# EAGLE design r2r_ladder_dac (EAGLE 6.2)
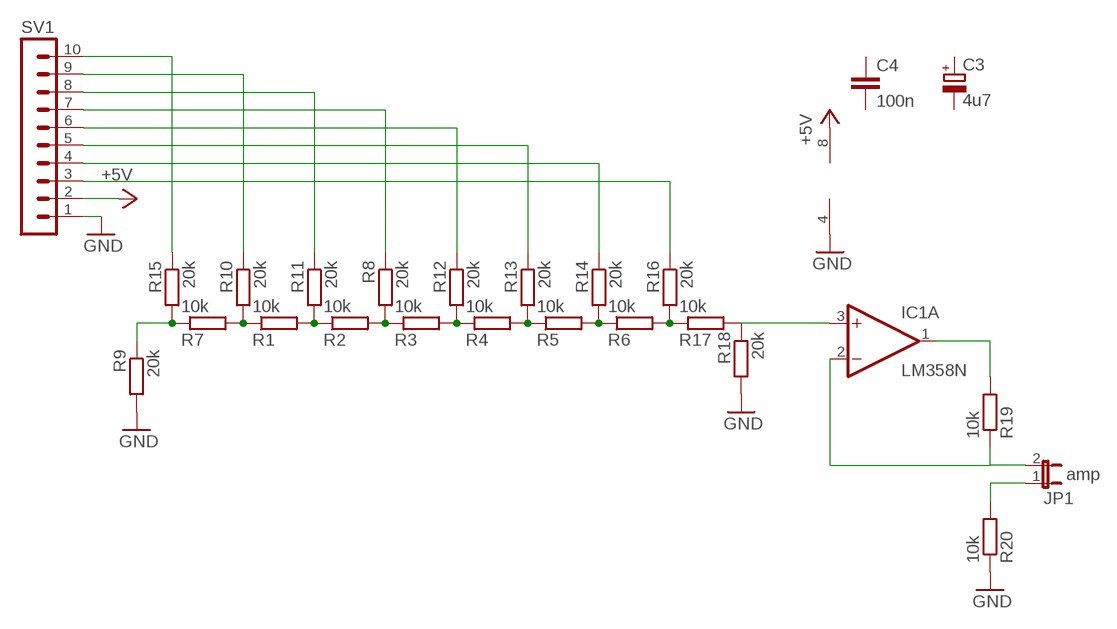
[diagram p0: schematic, sheet 1]

## Parts
C3  4u7  CPOL-EUTT2D5  [TT2D5]
C4  100n  C-EU025-024X044  [C025-024X044]
IC1  LM358N  [DIL08]
JP1  amp  JP1E  [JP1]
R1  10k  R-EU_0204/2V  [0204V]
R2  10k  R-EU_0204/2V  [0204V]
R3  10k  R-EU_0204/2V  [0204V]
R4  10k  R-EU_0204/2V  [0204V]
R5  10k  R-EU_0204/2V  [0204V]
R6  10k  R-EU_0204/2V  [0204V]
R7  10k  R-EU_0204/2V  [0204V]
R8  20k  R-EU_0207/10  [0207/10]
R9  20k  R-EU_0617/22  [0617/22]
R10  20k  R-EU_0207/10  [0207/10]
R11  20k  R-EU_0207/10  [0207/10]
R12  20k  R-EU_0207/10  [0207/10]
R13  20k  R-EU_0207/10  [0207/10]
R14  20k  R-EU_0207/10  [0207/10]
R15  20k  R-EU_0207/10  [0207/10]
R16  20k  R-EU_0207/10  [0207/10]
R17  10k  R-EU_0204/5  [0204/5]
R18  20k  R-EU_0207/10  [0207/10]
R19  10k  R-EU_0204/2V  [0204V]
R20  10k  R-EU_0204/2V  [0204V]
SV1  MA10-1W  [MA10-1W]

## Nets
+5V: IC1.8(P:V+) SV1.2
GND: IC1.4(P:V-) R9.2 R18.2 R20.1 SV1.1
N$1: R1.2 R2.1 R11.2
N$2: R2.2 R3.1 R8.2
N$3: R3.2 R4.1 R12.2
N$4: R7.1 R9.1 R15.2
N$5: R4.2 R5.1 R13.2
N$6: R5.2 R6.1 R14.2
N$7: R1.1 R7.2 R10.2
N$8: R6.2 R16.2 R17.1
N$9: R15.1 SV1.10
N$10: R10.1 SV1.9
N$11: R11.1 SV1.8
N$12: R8.1 SV1.7
N$13: R12.1 SV1.6
N$14: R13.1 SV1.5
N$15: R14.1 SV1.4
N$16: R16.1 SV1.3
N$17: IC1.3(A:+IN) R17.2 R18.1
N$18: IC1.1(A:OUT) R19.2
N$19: IC1.2(A:-IN) JP1.2 R19.1
N$20: JP1.1 R20.2
Unconnected: C3.+ C3.- C4.1 C4.2 IC1.5(B:+IN) IC1.6(B:-IN) IC1.7(B:OUT)

## Library data of the parts
C3 = rcl:CPOL-EU: POLARIZED CAPACITOR, European symbol
C4 = rcl:C-EU: CAPACITOR, European symbol
IC1 = linear:LM358: OP AMP also LM158; LM258; LM2904 Source: http://cache.national.com/ds/LM/LM158.pdf
JP1 = jumper:JP1E: JUMPER
R1-R20 = rcl:R-EU_: RESISTOR, European symbol
SV1 = con-lstb:MA10-1W: PIN HEADER

## Board
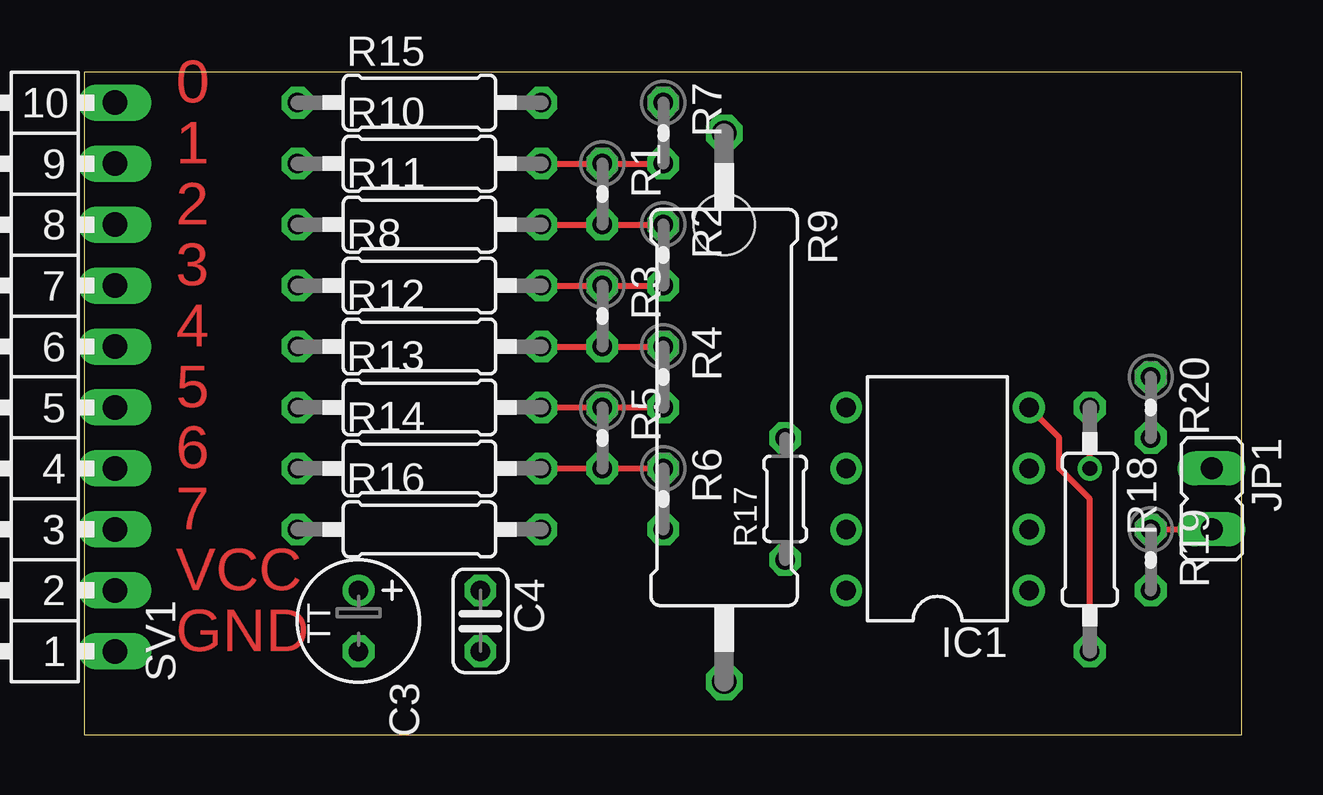
[diagram p1: board, top side]
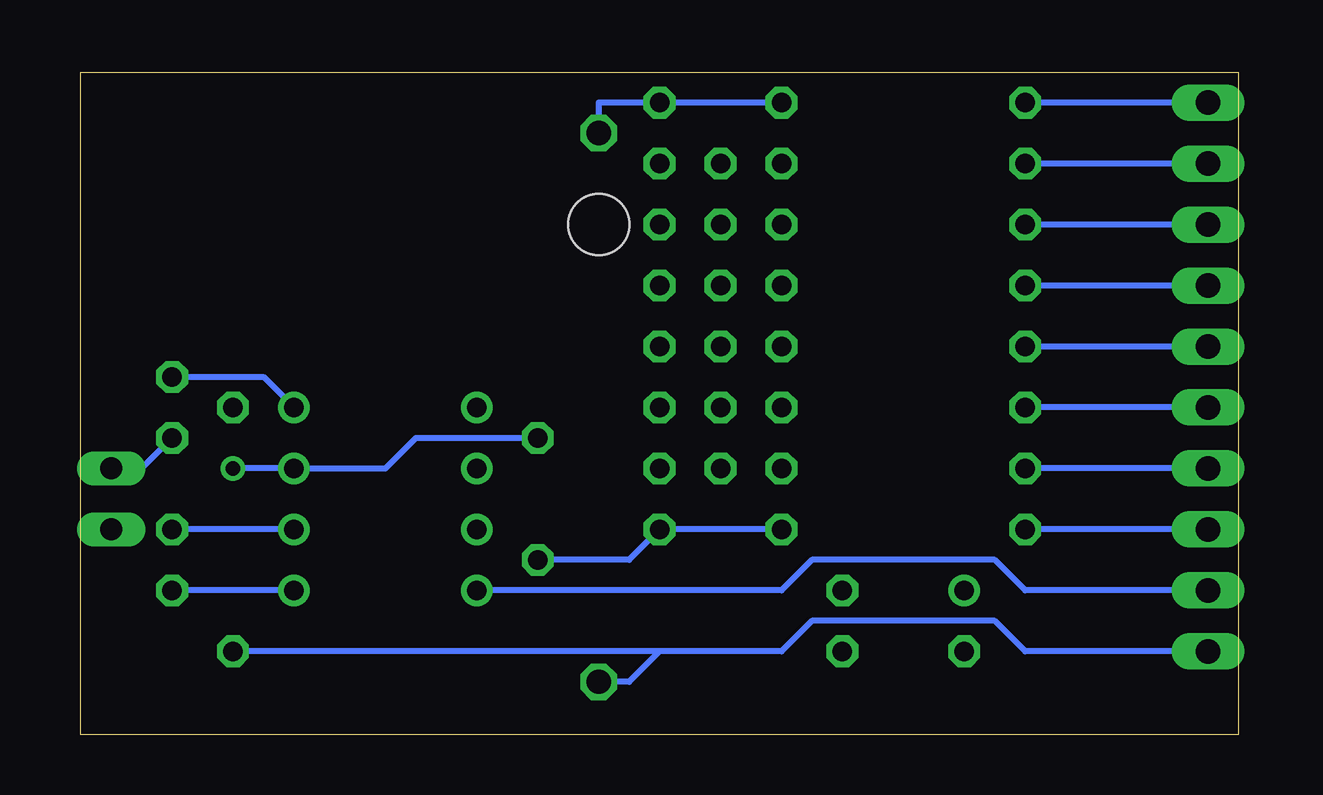
[diagram p2: board, bottom side, seen from below]

Size 48.25 x 27.61 mm. Coordinates in mm from the lower left corner, seen from the top.
Outline: 0,27.61 0,0 48.25,0 48.25,27.61 0,27.61
Copper layers (1*16): Top 0.035mm / dielectric 1.5mm / Bottom 0.035mm
Design rules: minimum track width 10mil, minimum drill 24mil, track to track 8mil, track to pad 8mil, pad to pad 8mil, via to via 8mil, smd to smd 8mil, copper to edge 40mil, drill to drill 8mil, minimum pad ring 10mil, minimum via ring 8mil, stop-mask expansion 4mil, vias tented up to drill 0mil, thermal gap 10mil
Holes 2.54 mm at 26.67,21.26

### Footprints (pad centres in the part's own frame; a part is rotated, then mirrored left to right if it is on the bottom)
TT2D5 = drill 0.813: + -1.27,0 | drill 0.813 octagon: - 1.27,0
C025-024X044 = drill 0.813 octagon: 1 -1.27,0; 2 1.27,0
DIL08 = drill 0.813 pad 1.27: 1 -3.81,-3.81; 2 -1.27,-3.81; 3 1.27,-3.81; 4 3.81,-3.81; 5 3.81,3.81; 6 1.27,3.81; 7 -1.27,3.81; 8 -3.81,3.81
JP1 = drill 0.914 long: 1 0,-1.27; 2 0,1.27
0204V = drill 0.813 octagon: 1 -1.27,0; 2 1.27,0
0207/10 = drill 0.813 octagon: 1 -5.08,0; 2 5.08,0
0617/22 = drill 1.016 octagon: 1 -11.43,0; 2 11.43,0
0204/5 = drill 0.813 octagon: 1 -2.54,0; 2 2.54,0
MA10-1W = drill 1.016 long: 1 -11.43,0; 2 -8.89,0; 3 -6.35,0; 4 -3.81,0; 5 -1.27,0; 6 1.27,0; 7 3.81,0; 8 6.35,0; 9 8.89,0; 10 11.43,0

### Placement (x,y rotation side)
C3  11.43,4.75 270 top
C4  16.51,4.75 270 top
IC1  35.56,9.83 90 top
JP1  46.99,9.83 180 top
R1  21.59,22.53 270 top
R2  24.13,19.99 270 top
R3  21.59,17.45 270 top
R4  24.13,14.91 270 top
R5  21.59,12.37 270 top
R6  24.13,9.83 270 top
R7  24.13,25.07 270 top
R8  13.97,18.72 0 top
R9  26.67,13.64 270 top
R10  13.97,23.8 0 top
R11  13.97,21.26 0 top
R12  13.97,16.18 0 top
R13  13.97,13.64 0 top
R14  13.97,11.1 0 top
R15  13.97,26.34 0 top
R16  13.97,8.56 0 top
R17  29.21,9.83 90 top
R18  41.91,8.56 270 top
R19  44.45,7.29 270 top
R20  44.45,13.64 270 top
SV1  1.27,14.91 90 top

### Tracks (layer width: path | path; a pad name or v marks a point on that pad's centre or on a via)
+5V
  Bottom 0.254: IC1.8 19.05,6.02 17.78,7.29 10.16,7.29 8.89,6.02 SV1.2
GND
  Top 0.254: IC1.4 40.64,12.37 40.64,11.1 41.91,9.83 R18.2
  Bottom 0.254: IC1.4 40.64,14.91 R20.1 | 24.13,3.48 19.05,3.48 17.78,4.75 10.16,4.75 8.89,3.48 SV1.1 | 24.13,3.48 R18.2 | R9.2 25.4,2.21 24.13,3.48
N$1
  Top 0.254: R11.2 R1.2 R2.1
N$2
  Top 0.254: R8.2 R3.1 R2.2
N$3
  Top 0.254: R12.2 R3.2 R4.1
N$4
  Bottom 0.254: R15.2 R7.1 26.67,26.34 R9.1
N$5
  Top 0.254: R13.2 R5.1 R4.2
N$6
  Top 0.254: R14.2 R5.2 R6.1
N$7
  Top 0.254: R10.2 R1.1 R7.2
N$8
  Bottom 0.254: R16.2 R6.2 25.4,7.29 R17.1
N$9
  Bottom 0.254: SV1.10 R15.1
N$10
  Bottom 0.254: SV1.9 R10.1
N$11
  Bottom 0.254: SV1.8 R11.1
N$12
  Bottom 0.254: SV1.7 R8.1
N$13
  Bottom 0.254: SV1.6 R12.1
N$14
  Bottom 0.254: SV1.5 R13.1
N$15
  Bottom 0.254: SV1.4 R14.1
N$16
  Bottom 0.254: SV1.3 R16.1
N$17  (via drill 0.61)
  Top 0.254: v41.91,11.1 R18.1
  Bottom 0.254: R17.2 34.29,12.37 35.56,11.1 IC1.3 v41.91,11.1
N$18
  Bottom 0.254: IC1.1 R19.2
N$19
  Top 0.254: R19.1 JP1.2
  Bottom 0.254: IC1.2 R19.1
N$20
  Bottom 0.254: R20.2 45.72,11.1 JP1.1

### Text on the board
Top: 0 | 1 | 2 | 3 | 4 | 5 | 6 | 7 | VCC | GND